# EAGLE design SpaceInvaders-OtherMill-BottomOnly (EAGLE 8.0.0)
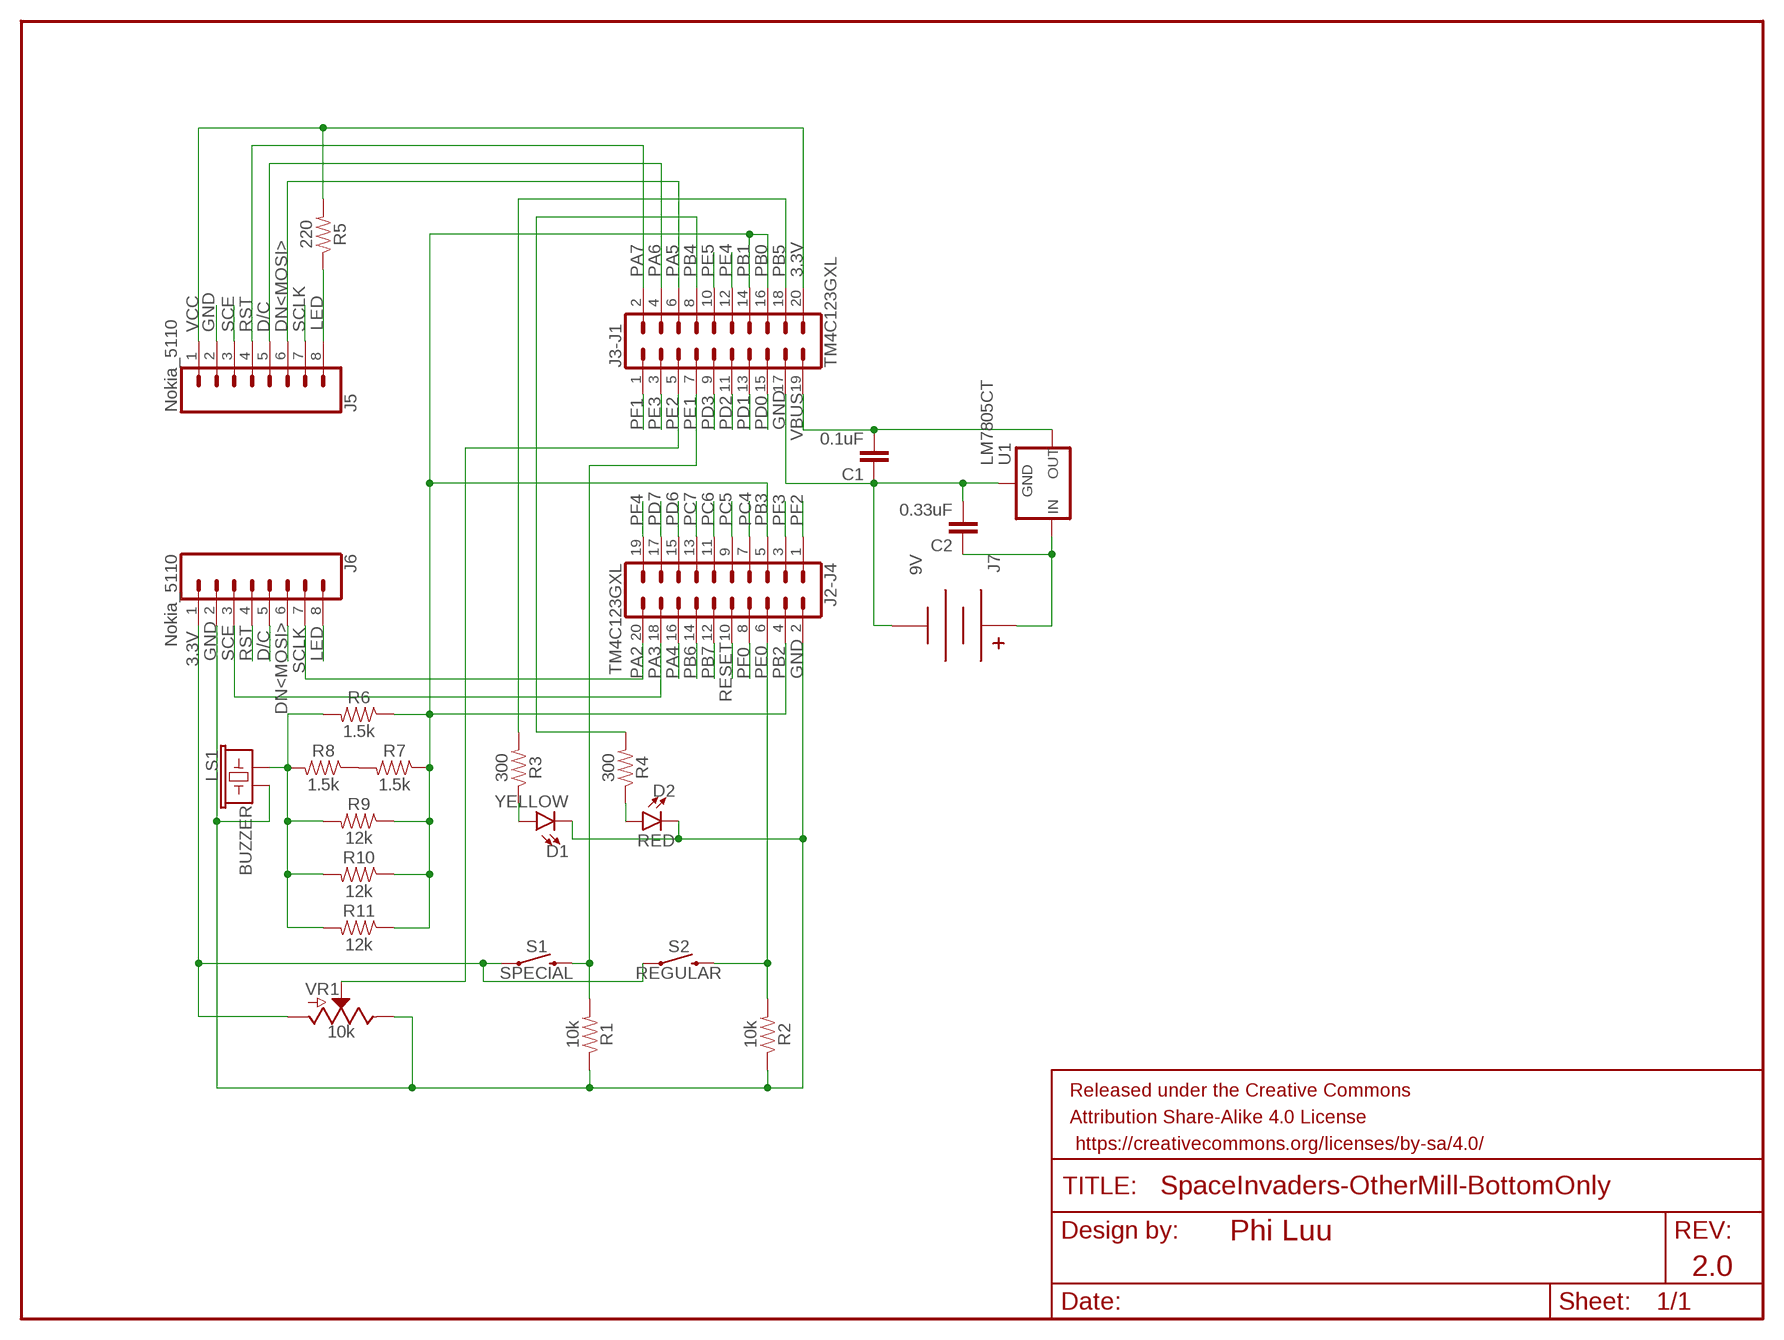
[diagram p0: schematic, sheet 1]

## Parts
C1  0.1uF  0.1UF-KIT-EZ-50V-20%  [CAP-PTH-SMALL-KIT]
C2  0.33uF  0.1UF-KIT-EZ-50V-20%  [CAP-PTH-SMALL-KIT]
D1  YELLOW  LED5MM  [LED_5MM]
D2  RED  LED5MM  [LED_5MM]
FRAME1  FRAME-LETTER  [CREATIVE_COMMONS]
J2-J4  TM4C123GXL  CONN_10X2  [2X10]
J3-J1  TM4C123GXL  CONN_10X2  [2X10]
J5  Nokia_5110  CONN_08"  [1X08]
J6  Nokia_5110  CONN_08"  [1X08]
J7  9V  BC9VPC  [BC9VPC]
LS1  BUZZER  BUZZER-PTH  [BUZZER-12MM]
R1  10k  10KOHM-HORIZ-1/4W-5%  [AXIAL-0.3]
R2  10k  10KOHM-HORIZ-1/4W-5%  [AXIAL-0.3]
R3  300  1KOHM-HORIZ-1/4W-5%  [AXIAL-0.3]
R4  300  1KOHM-HORIZ-1/4W-5%  [AXIAL-0.3]
R5  220  1KOHM-HORIZ-1/4W-5%  [AXIAL-0.3]
R6  1.5k  1KOHM-HORIZ-1/4W-5%  [AXIAL-0.3]
R7  1.5k  1KOHM-HORIZ-1/4W-5%  [AXIAL-0.3]
R8  1.5k  1KOHM-HORIZ-1/4W-5%  [AXIAL-0.3]
R9  12k  1KOHM-HORIZ-1/4W-5%  [AXIAL-0.3]
R10  12k  1KOHM-HORIZ-1/4W-5%  [AXIAL-0.3]
R11  12k  1KOHM-HORIZ-1/4W-5%  [AXIAL-0.3]
S1  SPECIAL  MOMENTARY-SWITCH-SPST-PTH-6.0MM  [TACTILE_SWITCH_PTH_6.0MM]
S2  REGULAR  MOMENTARY-SWITCH-SPST-PTH-6.0MM  [TACTILE_SWITCH_PTH_6.0MM]
U1  LM7805CT  V_REG_78XX-TO-220  [TO-220-ALT]
VR1  10k  POTENTIOMETER_SLIDE-30MM-1/10W-20%  [SLIDER-MEDIUM]

## Nets
3.3V [power]: J3-J1.20 J5.1 J6.1 R5.P$2 S1.1 S2.1 VR1.BOTTOM(A)
9V [power]: C2.1 J7.V+ U1.IN
D/C: J6.5
DAC_OUT: LS1.+ R6.P$2 R8.P$2 R9.P$2 R10.P$2 R11.P$2
DN<MOSI>: J6.6
GND: C1.1 C2.2 D1.K(C) D2.K(C) J2-J4.2 J3-J1.17 J5.2 J6.2 J7.V- LS1.- R1.P$1 R2.P$1 U1.GND VR1.TOP(E)
LED: J5.8 J6.8 R5.P$1
LLED: D1.A R3.P$1
N$1: R7.P$2 R8.P$1
PA2: J2-J4.20 J6.7
PA3: J2-J4.18 J6.3
PA4: J2-J4.16
PA5: J3-J1.6 J5.6
PA6: J3-J1.4 J5.5
PA7: J3-J1.2 J5.4
PB2: J2-J4.4 J2-J4.5 J3-J1.14 J3-J1.16 R6.P$1 R7.P$1 R9.P$1 R10.P$1 R11.P$1
PB4: J3-J1.8 R4.P$2
PB5: J3-J1.18 R3.P$2
PB6: J2-J4.14
PB7: J2-J4.12
PC4: J2-J4.7
PC5: J2-J4.9
PC6: J2-J4.11
PC7: J2-J4.13
PD0: J3-J1.15
PD1: J3-J1.13
PD2: J3-J1.11
PD3: J3-J1.9
PD6: J2-J4.15
PD7: J2-J4.17
PE0: J2-J4.6 R2.P$2 S2.3
PE1: J3-J1.7 R1.P$2 S1.3
PE2: J3-J1.5 VR1.WIPER(S)
PE3: J3-J1.3
PE4: J3-J1.12
PE5: J3-J1.10
PF0: J2-J4.8
PF1: J3-J1.1
PF2: J2-J4.1
PF3: J2-J4.3
PF4: J2-J4.19
RESET: J2-J4.10
RLED: D2.A R4.P$1
RST: J6.4
SCE: J5.3
SCLK: J5.7
VBUS [power]: C1.2 J3-J1.19 U1.OUT

## Notes on the sheet
- PB1 | PB0
- VCC | RST | D/C | DN<MOSI>
- PB3
- SCE
- SCLK
- Phi Luu
- 2.0

## Library data of the parts
C1 = SparkFun-Capacitors:0.1UF: 0.1µF ceramic capacitors A capacitor is a passive two-terminal electrical component used to store electrical energy temporarily in an electric field.; PROD_ID: CAP-08370
C2 = SparkFun-Capacitors:0.1UF: 0.1µF ceramic capacitors A capacitor is a passive two-terminal electrical component used to store electrical energy temporarily in an electric field.; PROD_ID: CAP-08370; VALUE: 0.1uF
D1 D2 = SparkFun-LED:LED: LED (Generic) Standard schematic elements and footprints for 5mm, 3mm, 1206, and 0603 sized LEDs. Generic LEDs with no color specified.
FRAME1 = SparkFun-Aesthetics:FRAME-LETTER: Schematic Frame - Letter Standard 8.5x11 US Letter frame
J2-J4 J3-J1 = SparkFun-Connectors:CONN_10X2: Multi connection point. Often used as Generic Header-pin footprint for 0.1 inch spaced/style header connections On any of the 0.1 inch spaced packages, you can populate with these: Break Away Headers - Straight <https://www.sparkfun.com/products/116> (PRT-00116) Break Away Male Headers - Right Angle <https://www.sparkfun.com/products/553> (PRT-00553) Female Headers <https://www.sparkfun.com/products/115> (PRT-00115) Break Away Headers - Machine Pin <https://www.sparkfun.com/products/117> (PRT-00117) Break Away Female Headers - Swiss Machine Pin <https://www.sparkfun.com/products/743> (PRT-00743) Special note about the "SPECIAL" package: This was SPECIALLY designed to be used with our Graphic LCD Backpack. Be sure you want to use this! It is not only staggered on each line of header holes, but IT IS ALSO offset of the center point of the top and bottom lines by 5 mil. This causes the headers to lock into place on the "standard" footprint on the LCD screen. The extra squares on the tdocu layer are there simply to reference other pins (if you were to actually populate a longer header than ten long - this is what we do with the backpacks).
J5 J6 = SparkFun-Connectors:CONN_08: Multi connection point. Often used as Generic Header-pin footprint for 0.1 inch spaced/style header connections On any of the 0.1 inch spaced packages, you can populate with these: Break Away Headers - Straight <https://www.sparkfun.com/products/116> (PRT-00116) Break Away Male Headers - Right Angle <https://www.sparkfun.com/products/553> (PRT-00553) Female Headers <https://www.sparkfun.com/products/115> (PRT-00115) Break Away Headers - Machine Pin <https://www.sparkfun.com/products/117> (PRT-00117) Break Away Female Headers - Swiss Machine Pin <https://www.sparkfun.com/products/743> (PRT-00743) Arduino Stackable Header - 8 Pin <https://www.sparkfun.com/products/9279> (PRT-09279) For SCREWTERMINALS and SPRING TERMINALS visit here: Screw Terimnals on SparkFun.com <https://www.sparkfun.com/search/results?term=Screw+Terminals> (5mm/3.5mm/2.54mm spacing) This device is also useful as a general connection point to wire up your design to another part of your project. Our various solder wires solder well into these plated through hole pads. Hook-Up Wire - Assortment (Stranded, 22 AWG) <https://www.sparkfun.com/products/11375> (PRT-11375) Hook-Up Wire - Assortment (Solid Core, 22 AWG) <https://www.sparkfun.com/products/11367> (PRT-11367) View the entire wire category on our website here <https://www.sparkfun.com/categories/141> Special notes: Molex polarized connector foot print use with SKU : PRT-08231 with associated crimp pins and housings. 1MM SMD Version SKU: PRT-10208 NOTES ON THE VARIANTS LOCK and LOCK_LONGPADS... This footprint was designed to help hold the alignment of a through-hole component (i.e. 6-pin header) while soldering it into place. You may notice that each hole has been shifted either up or down by 0.005 of an inch from it's more standard position (which is a perfectly straight line). This slight alteration caused the pins (the squares in the middle) to touch the edges of the holes. Because they are alternating, it causes a "brace" to hold the component in place. 0.005 has proven to be the perfect amount of "off-center" position when using our standard breakaway headers. Although looks a little odd when you look at the bare footprint, once you have a header in there, the alteration is very hard to notice. Also,if you push a header all the way into place, it is covered up entirely on the bottom side.; PROD_ID: CONN-08438
J7 = SparkFun-Connectors:BC9VPC: 9V Battery Holder - PC Mount Standard and Kit footprints included SparkFun Products: SparkFun SparkPunk Sound Kit <https://www.sparkfun.com/products/11177> SparkFun SparkPunk Sequencer Kit <https://www.sparkfun.com/products/12707>; PROD_ID: BATT-10855
LS1 = SparkFun-Electromechanical:BUZZER: Buzzer Small round buzzers that operate around the audible 2kHz range. You can use these as speakers to create simple music or user interfaces. Variant Overview: PTH - Mini Speaker - PC Mount 12mm 2.048kHz <https://www.sparkfun.com/products/7950> PTH_KIT - Mini Speaker - PC Mount 12mm 2.048kHz <https://www.sparkfun.com/products/7950> KIT simplifies soldering by adding stop mask to one side of the pads. PTH_NO_SILK - Mini Speaker - PC Mount 12mm 2.048kHz <https://www.sparkfun.com/products/7950> No silkscreen indicator of buzzer outline. PTH_KIT_NO_SILK - Mini Speaker - PC Mount 12mm 2.048kHz <https://www.sparkfun.com/products/7950> KIT package w/o silkscreen SMD - Buzzer Audio Magnetic (CCV-084B16) SMD buzzer used on, e.g. the LilyPad Buzzer <https://www.sparkfun.com/products/8463> and RFID USB Reader <https://www.sparkfun.com/products/9963>. SMD_KIT - Buzzer Audio Magnetic (CCV-084B16) SMD Buzzer with elongated pins to make soldering easier. Used on the SparkFun Simon Says - Surface Mount Soldering Kit <https://www.sparkfun.com/products/10935>.; PROD_ID: COMP-08253; SF_SKU: COM-07950
R1 R2 = SparkFun-Resistors:10KOHM: 10kΩ resistor A resistor is a passive two-terminal electrical component that implements electrical resistance as a circuit element. Resistors act to reduce current flow, and, at the same time, act to lower voltage levels within circuits. - Wikipedia; PROD_ID: RES-09435
R3-R11 = SparkFun-Resistors:1KOHM: 1kΩ resistor A resistor is a passive two-terminal electrical component that implements electrical resistance as a circuit element. Resistors act to reduce current flow, and, at the same time, act to lower voltage levels within circuits. - Wikipedia; PROD_ID: RES-08380; VALUE: 1k
S1 S2 = SparkFun-Switches:MOMENTARY-SWITCH-SPST: Momentary Switch (Pushbutton) - SPST Normally-open (NO) SPST momentary switches (buttons, pushbuttons). Variants PTH-12MM - 12mm square, through-hole Momentary Pushbutton Switch - 12mm Square <https://www.sparkfun.com/products/9190> (COM-09190) PTH-6.0MM, PTH-6.0MM-KIT - 6.0mm square, through-hole Mini Pushbutton Switch <https://www.sparkfun.com/products/97> (COM-00097) KIT package intended for soldering kit's - only one side of pads' copper is exposed. PTH-RIGHT-ANGLE-KIT - Right-angle, through-hole Right Angle Tactile Button <https://www.sparkfun.com/products/10791> - Used on SparkFun BigTime Watch Kit <https://www.sparkfun.com/products/11734> SMD-12MM - 12mm square, surface-mount Tactile Button - SMD (12mm) <https://www.sparkfun.com/products/12993> (COM-12993) Used on SparkFun PicoBoard <https://www.sparkfun.com/products/11888> SMD-4.5MM - 4.5mm Square Trackball Switch Used on SparkFun Blackberry Trackballer Breakout <https://www.sparkfun.com/products/13169> SMD-4.6MMX2.8MM - 4.60mm x 2.80mm, surface mount Used on SparkFun SAMD21 Mini Breakout <https://www.sparkfun.com/products/13664> SMD-5.2MM, SMD-5.2-REDUNDANT - 5.2mm square, surface-mount Mini Pushbutton Switch - SMD <https://www.sparkfun.com/products/8720> (COM-08720) Used on Arduino Pro Mini <https://www.sparkfun.com/products/11114> REDUNDANT package connects both switch circuits together SMD-6.0X3.5MM - 6.0 x 3.5mm, surface mount Momentary Reset Switch SMD <https://www.sparkfun.com/products/8229> (COM-08229) SMD-6.2MM-TALL - 6.2mm square, surface mount Tactile Button - SMD (6mm) <https://www.sparkfun.com/products/12992> Used on SparkFun Digital Sandbox <https://www.sparkfun.com/products/12651> SMD-RIGHT-ANGLE - Right-angle, surface mount Used on SparkFun Block for Intel® Edison - Arduino <https://www.sparkfun.com/products/13036>; PROD_ID: SWCH-08441; SF_SKU: COM-00097
U1 = SparkFun-IC-Power:V_REG_78XX: Voltage Regulator Standard 78xx regulator. IGO (Input Ground Output). Spark Fun Electronics SKU : COM-00107; PROD_ID: VREG-08450; SF_ID: COM-00107
VR1 = SparkFun-Resistors:POTENTIOMETER_SLIDE: Slide Potentiometer Slide-type potentiometers - pots that are adjusted by sliding a wiper up or down. Commonly found en-masse on sound boards. Variants 60MM - Slide Pot - X-Large (10k Linear Taper) <https://www.sparkfun.com/products/9119> (COM-09119) 10k linear slide pot with 60mm travel. Datasheet <http://cdn.sparkfun.com/datasheets/Components/Switches/SC608N-b10k.pdf> 30MM, 30MM-KIT - Slide Pot - Medium (10k Linear Taper) <https://www.sparkfun.com/products/11621> (COM-11621) 10k linear slide pot with 30mm travel. Datasheet <http://cdn.sparkfun.com/datasheets/Components/Switches/C-31-.pdf> (C3031N-1A2-B10K-GP) "KIT" variant, intended for soldering kits, has tStop removed from pads so the component can only be stuffed on one side of the board. 20MM - Slide Pot - Small (10k Linear Taper) <https://www.sparkfun.com/products/11620> (COM-11620) 10k linear slide pot with 20mm travel. Datasheet <http://cdn.sparkfun.com/datasheets/Components/Switches/C-31-.pdf> (C2031N-1A2-B10K-GP); PROD_ID: RES-11931; SF_SKU: COM-11621

## Net classes
0 default: width 0.254 mm
1 power: width 0.305 mm

## Board
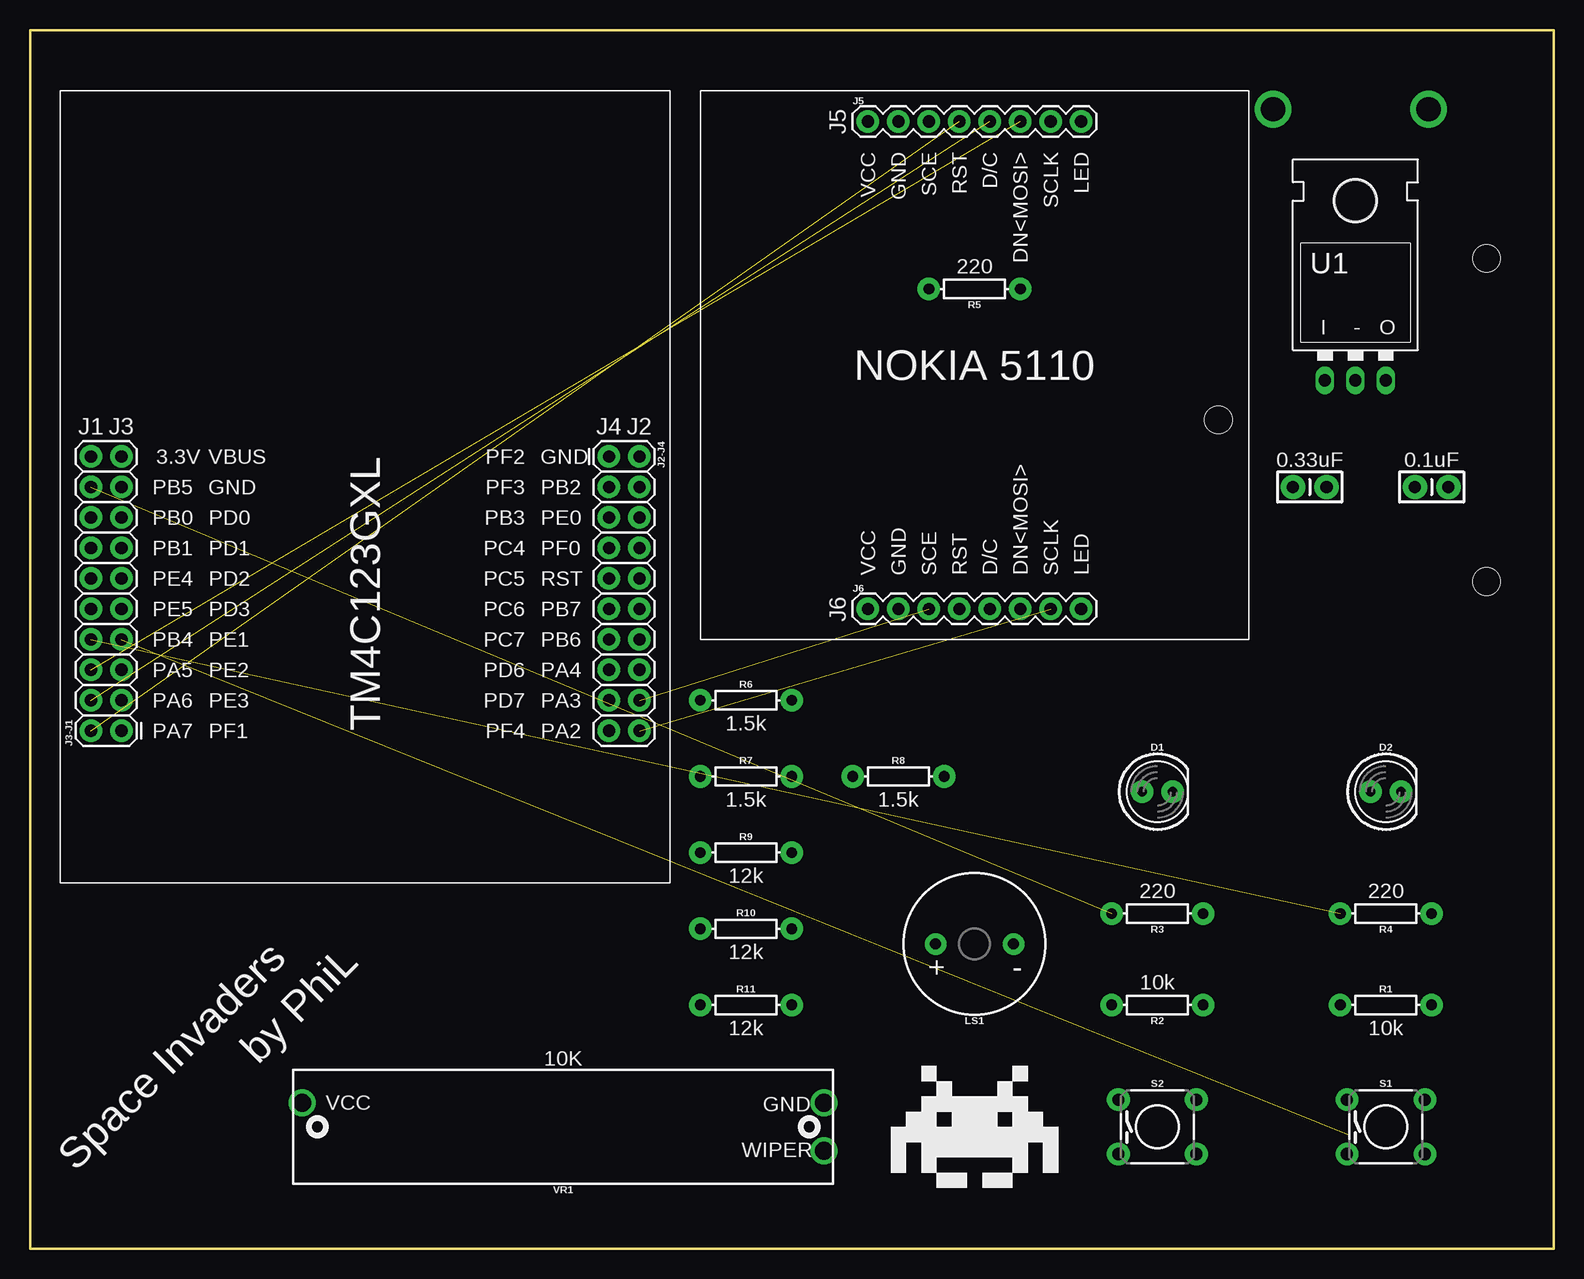
[diagram p1: board, top side]
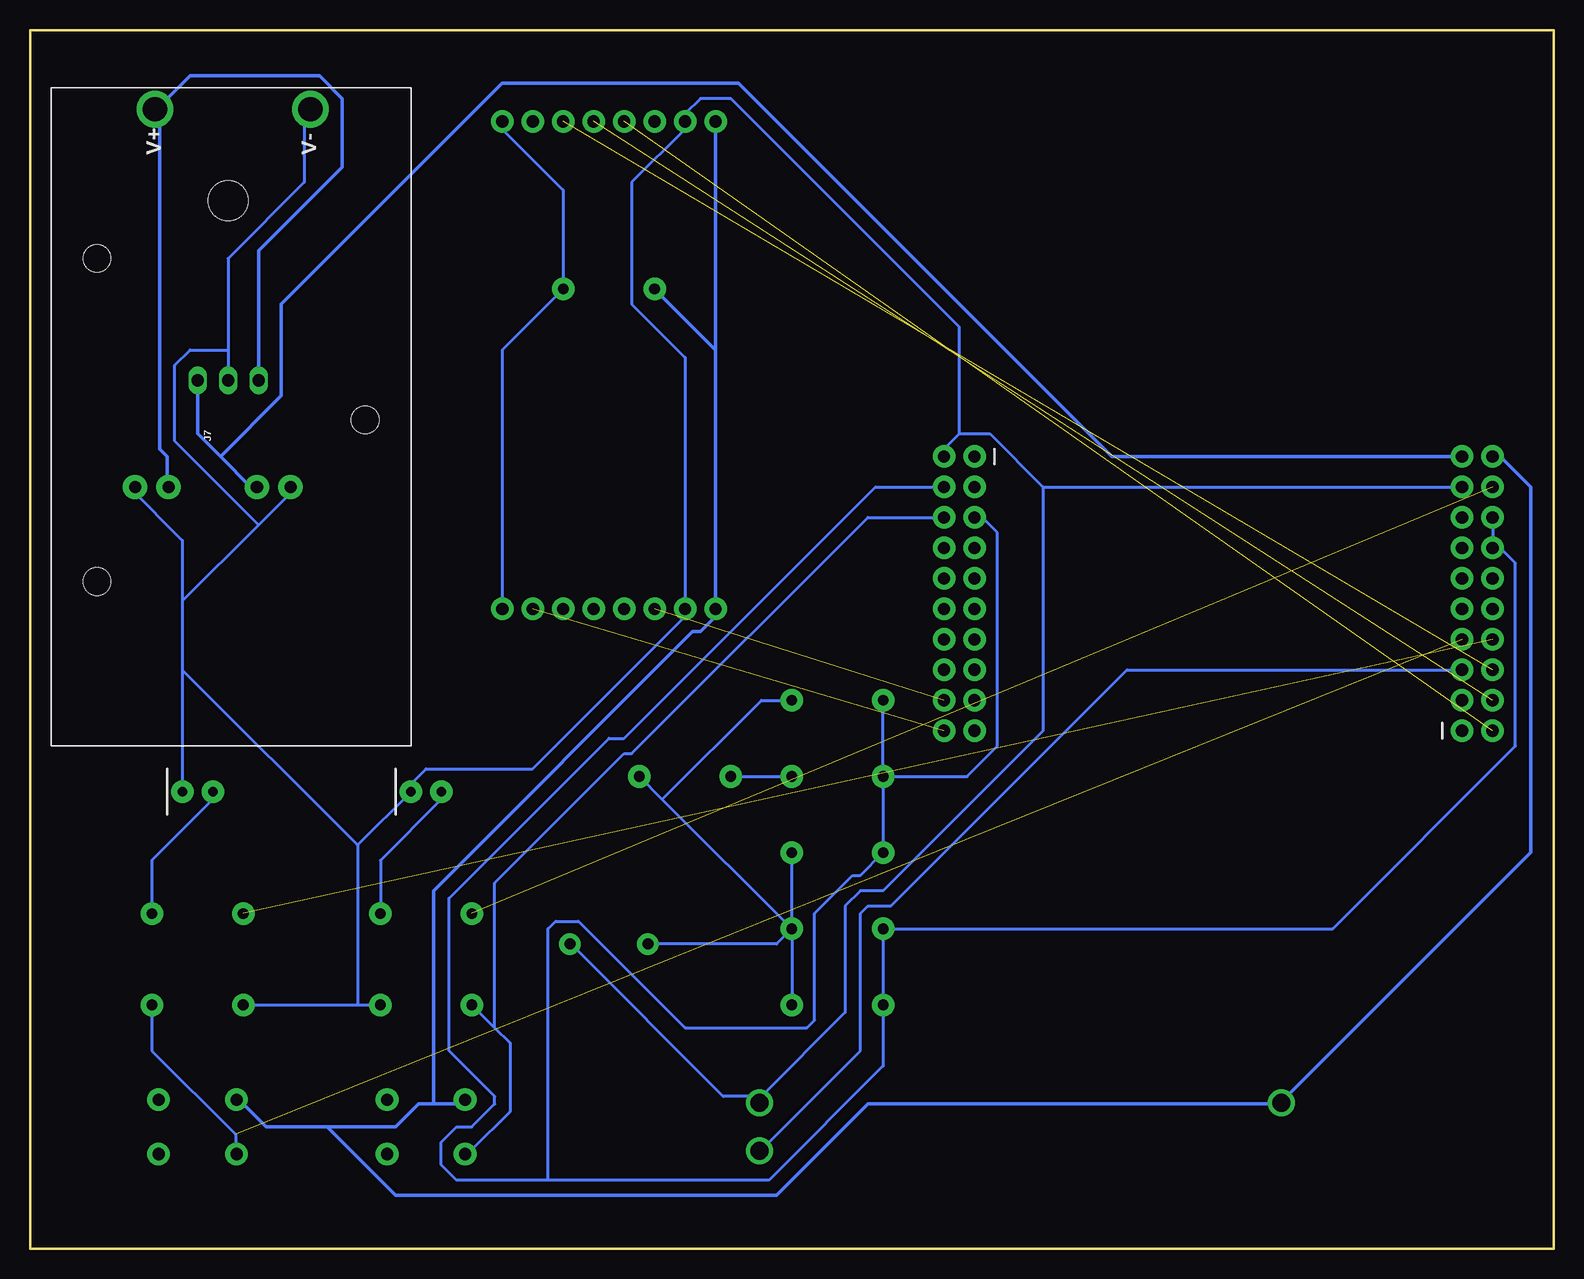
[diagram p2: board, bottom side, seen from below]

Size 127 x 101.6 mm. Coordinates in mm from the lower left corner, seen from the top.
Outline: 0,0 0,101.6 127,101.6 127,0 0,0
Copper layers (1*16): Top 0.035mm / dielectric 1.5mm / Bottom 0.035mm
Design rules "OthermillDRC_1_32_v2": minimum track width 8mil, minimum drill 0.8mm, track to track 0.794003125mm, track to pad 0.794003125mm, pad to pad 0.794003125mm, via to via 0.794003125mm, smd to smd 0mil, copper to edge 0mil, drill to drill 1mil, minimum pad ring 10mil, minimum via ring 10mil, stop-mask expansion 1mil, vias tented up to drill 30mil, thermal gap 10mil

### Footprints (pad centres in the part's own frame; a part is rotated, then mirrored left to right if it is on the bottom)
CAP-PTH-SMALL-KIT = drill 1.016 pad 2.032: 1 -1.397,0; 2 1.397,0
LED_5MM = drill 0.813 pad 1.88: A -1.27,0; K 1.27,0
2X10 = drill 1.016 pad 1.88: 1 0,0; 2 0,2.54; 3 2.54,0; 4 2.54,2.54; 5 5.08,0; 6 5.08,2.54; 7 7.62,0; 8 7.62,2.54; 9 10.16,0; 10 10.16,2.54; 11 12.7,0; 12 12.7,2.54; 13 15.24,0; 14 15.24,2.54; 15 17.78,0; 16 17.78,2.54; 17 20.32,0; 18 20.32,2.54; 19 22.86,0; 20 22.86,2.54
1X08 = drill 1.016 pad 1.88: 1 0,0; 2 2.54,0; 3 5.08,0; 4 7.62,0; 5 10.16,0; 6 12.7,0; 7 15.24,0; 8 17.78,0
BC9VPC = drill 2.032: V+ 53.086,21.336; V- 53.086,8.382 | hole 2.286: 27.178,3.81; 13.716,26.162; 40.64,26.162
BUZZER-12MM = drill 0.9 pad 1.778: + 3.25,0; - -3.25,0
AXIAL-0.3 = drill 0.9 pad 1.88: P$1 -3.81,0; P$2 3.81,0
TACTILE_SWITCH_PTH_6.0MM = drill 1.016 pad 1.88: 1 -3.251,2.261; 2 3.251,2.261; 3 -3.251,-2.261; 4 3.251,-2.261
TO-220-ALT = drill 1.016 long: GND 0,-3.81; IN -2.54,-3.81; OUT 2.54,-3.81 | hole 3.302: 0,11.176
SLIDER-MEDIUM = drill 1.5: BOTTOM 21.75,-2; TOP -21.75,-2; WIPER -21.75,2

### Placement (x,y rotation side)
C1  106.68,63.5 0 top
C2  116.84,63.5 0 top
D1  RED  [LED_5MM]  93.98,38.1 0 top
D2  YELLOW  [LED_5MM]  113.03,38.1 0 top
FRAME1  30.48,-8.89 0 top  (outside the outline)
J2-J4  48.26,66.04 270 top
J3-J1  7.62,43.18 90 top
J5  69.85,93.98 0 top
J6  69.85,53.34 0 top
J7  95.25,41.91 90 bottom
LS1  78.74,25.4 180 top
R1  113.03,20.32 0 top
R2  93.98,20.32 180 top
R3  220  [AXIAL-0.3]  93.98,27.94 180 top
R4  220  [AXIAL-0.3]  113.03,27.94 180 top
R5  78.74,80.01 180 top
R6  59.69,45.72 0 top
R7  59.69,39.37 0 top
R8  72.39,39.37 0 top
R9  59.69,33.02 0 top
R10  59.69,26.67 0 top
R11  59.69,20.32 0 top
S1  113.03,10.16 0 top
S2  93.98,10.16 0 top
U1  110.49,76.2 0 top
VR1  44.45,10.16 180 top

### Tracks (layer width: path | path; a pad name or v marks a point on that pad's centre or on a via)
3.3V
  Bottom 0.305: J3-J1.20 4.45,66.04 1.91,63.5 1.91,33.02 22.23,12.7 VR1.BOTTOM 22.86,12.06 57.15,12.06 64.77,4.45 96.52,4.45 102.23,10.16 | 93.34,12.06 94.61,12.06 96.52,10.16 102.23,10.16 | 93.34,12.06 90.81,12.06 S2.1 | 102.23,10.16 107.31,10.16 109.22,12.06 S1.1 | 69.85,74.93 J6.1 69.85,52.7 71.12,51.44 71.75,51.44 93.34,29.84 93.34,12.06 | R5.P$2 69.85,74.93 | 69.85,74.93 J5.1
9V
  Bottom 0.305: U1.IN 107.95,83.19 100.97,90.17 100.97,95.89 102.87,97.79 113.67,97.79 116.2,95.25 J7.V+ 116.2,94.61 116.2,66.67 115.57,66.04 115.57,63.5 C2.1
DAC_OUT
  Bottom 0.254: LS1.+ 64.77,25.4 R10.P$2 | R10.P$2 R11.P$2 | R10.P$2 R9.P$2 | R10.P$2 74.3,37.47 | 74.3,37.47 R8.P$2 | R6.P$2 66.04,45.72 74.3,37.47
GND
  Bottom 0.254: R1.P$1 99.69,20.32 | 99.69,20.32 R2.P$1 | 99.69,33.66 99.69,20.32 | 99.69,33.66 D1.K 95.25,38.73 93.98,40.01 85.09,40.01 72.39,52.7 J6.2 72.39,74.3 76.83,78.74 76.83,88.9 72.39,93.34 J5.2 72.39,94.61 71.12,95.89 68.58,95.89 49.53,76.83 49.53,67.94 | 110.49,74.93 110.49,82.55 104.14,88.9 104.14,94.61 J7.V- | 110.49,74.93 U1.GND | 114.3,53.98 114.3,59.05 118.75,63.5 C2.2 | 114.3,53.98 114.3,48.26 | 114.3,48.26 D2.K | 114.3,53.98 107.95,60.33 | 107.95,60.33 105.41,62.87 105.41,63.5 C1.1 | 110.49,74.93 113.67,74.93 114.94,73.66 114.94,67.31 107.95,60.33 | 114.3,48.26 99.69,33.66 | LS1.- 81.92,25.4 69.22,12.7 66.67,12.7 VR1.TOP 66.04,12.7 59.05,19.68 59.05,28.57 57.78,29.84 55.88,29.84 42.55,43.18 42.55,63.5 | 42.55,63.5 J3-J1.17 | 42.55,63.5 46.99,67.94 49.53,67.94 | 49.53,67.94 50.8,66.67 J2-J4.2
LED
  Bottom 0.254: J5.8 87.63,93.34 82.55,88.27 R5.P$1 87.63,74.93 J6.8
LLED
  Bottom 0.254: R3.P$1 97.79,32.38 92.71,37.47 D1.A
N$1
  Bottom 0.254: R8.P$1 R7.P$2
PA2  (1 unrouted)
PA3  (1 unrouted)
PA5  (1 unrouted)
PA6  (1 unrouted)
PA7  (1 unrouted)
PB2
  Bottom 0.254: J2-J4.5 47.62,60.96 46.35,59.69 46.35,41.91 48.9,39.37 R7.P$1 | R7.P$1 R9.P$1 57.78,31.11 58.42,31.11 61.59,27.94 61.59,19.05 62.23,18.41 72.39,18.41 81.28,27.3 83.19,27.3 83.82,26.67 83.82,5.71 | R7.P$1 R6.P$1 | J3-J1.16 J3-J1.14 4.45,58.42 3.17,57.15 3.17,41.91 18.41,26.67 R10.P$1 R11.P$1 55.88,15.24 65.41,5.71 83.82,5.71 | J2-J4.4 56.52,63.5 77.47,42.55 78.74,42.55 92.08,29.21 92.08,16.51 88.27,12.7 88.27,12.06 90.17,10.16 91.44,10.16 92.71,8.89 92.71,6.99 91.44,5.71 83.82,5.71
PB4  (1 unrouted)
PB5  (1 unrouted)
PE0
  Bottom 0.254: R2.P$2 88.27,18.41 | 88.27,18.41 87,17.14 87,11.43 90.17,8.26 S2.3 | J2-J4.6 57.15,60.96 76.83,41.27 77.47,41.27 88.27,30.48 88.27,18.41
PE1  (1 unrouted)
  Bottom 0.254: R1.P$2 116.84,16.51 109.86,9.53 109.86,8.26 S1.3
PE2
  Bottom 0.254: J3-J1.5 35.56,48.26 55.24,28.57 57.15,28.57 57.78,27.94 57.78,16.51 66.04,8.26 VR1.WIPER
RLED
  Bottom 0.254: R4.P$1 116.84,32.38 111.76,37.47 D2.A
VBUS
  Bottom 0.305: U1.OUT 113.03,67.94 111.12,66.04 | 111.12,66.04 108.58,63.5 C1.2 | J3-J1.19 36.83,66.04 67.94,97.16 87.63,97.16 106.05,78.74 106.05,71.12 111.12,66.04

### Text on the board
tPlace: J5 | VCC | GND | SCE | RST | D/C | DN<MOSI> | SCLK | LED | 220 | I | - | O | NOKIA 5110 | J1 | J3 | J4 | J2 | 3.3V | VBUS | PF2 | GND | 0.33uF | 0.1uF | PB5 | GND | PF3 | PB2 | PB0 | PD0 | PB3 | PE0 | PB1 | PD1 | PC4 | PF0 | PE4 | PD2 | PC5 | RST | VCC | GND | SCE | RST | D/C | DN<MOSI> | SCLK | LED | TM4C123GXL | PE5 | PD3 | PC6 | PB7 | J6 | PB4 | PE1 | PC7 | PB6 | PA5 | PE2 | PD6 | PA4 | PA6 | PE3 | PD7 | PA3 | 1.5k | PA7 | PF1 | PF4 | PA2 | 1.5k | 1.5k | 12k | 220 | 220 | 12k | + | - | 10k | 12k | 10k | 10K | by PhiL | VCC | GND | WIPER | Space Invaders
tDocu: Phi Luu